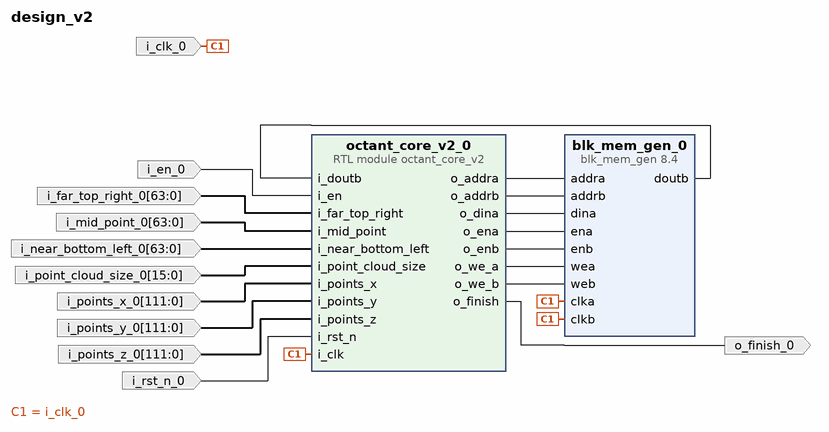
[diagram p0: block diagram of the top level]
# Vivado block design design_v2, xczu7ev-ffvc1156-2-e, Vivado 2021.2
create_bd_design design_v2

create_bd_port -dir I i_en_0
create_bd_port -dir I -from 15 -to 0 i_point_cloud_size_0
create_bd_port -dir I -type rst i_rst_n_0
create_bd_port -dir I -from 63 -to 0 i_mid_point_0
create_bd_port -dir I -from 63 -to 0 i_near_bottom_left_0
create_bd_port -dir I -from 63 -to 0 i_far_top_right_0
create_bd_port -dir I -type clk i_clk_0
create_bd_port -dir O o_finish_0
create_bd_port -dir I -from 111 -to 0 i_points_y_0
create_bd_port -dir I -from 111 -to 0 i_points_x_0
create_bd_port -dir I -from 111 -to 0 i_points_z_0

create_bd_cell -type ip -vlnv xilinx.com:ip:blk_mem_gen:8.4 blk_mem_gen_0
set_property -dict [list \
  CONFIG.Assume_Synchronous_Clk true \
  CONFIG.Enable_32bit_Address false \
  CONFIG.Enable_B Use_ENB_Pin \
  CONFIG.Fill_Remaining_Memory_Locations true \
  CONFIG.Memory_Type True_Dual_Port_RAM \
  CONFIG.Operating_Mode_A NO_CHANGE \
  CONFIG.Operating_Mode_B READ_FIRST \
  CONFIG.PRIM_type_to_Implement BRAM \
  CONFIG.Port_B_Clock 100 \
  CONFIG.Port_B_Enable_Rate 100 \
  CONFIG.Port_B_Write_Rate 50 \
  CONFIG.Read_Width_A 152 \
  CONFIG.Read_Width_B 152 \
  CONFIG.Register_PortA_Output_of_Memory_Primitives false \
  CONFIG.Register_PortB_Output_of_Memory_Primitives false \
  CONFIG.Remaining_Memory_Locations 0 \
  CONFIG.Use_Byte_Write_Enable false \
  CONFIG.Use_RSTA_Pin false \
  CONFIG.Write_Depth_A 16 \
  CONFIG.Write_Width_A 152 \
  CONFIG.Write_Width_B 152 \
  CONFIG.use_bram_block Stand_Alone \
] [get_bd_cells blk_mem_gen_0]
create_bd_cell -type module -reference octant_core_v2 octant_core_v2_0

# ---- connections ----

connect_bd_net [get_bd_pins blk_mem_gen_0/doutb] [get_bd_pins octant_core_v2_0/i_doutb]
connect_bd_net -net i_clk_0_1 [get_bd_ports i_clk_0] \
  [get_bd_pins blk_mem_gen_0/clkb] [get_bd_pins blk_mem_gen_0/clka] [get_bd_pins octant_core_v2_0/i_clk]
connect_bd_net -net i_en_0_1 [get_bd_ports i_en_0] [get_bd_pins octant_core_v2_0/i_en]
connect_bd_net -net i_far_top_right_0_1 [get_bd_ports i_far_top_right_0] [get_bd_pins octant_core_v2_0/i_far_top_right]
connect_bd_net -net i_mid_point_0_1 [get_bd_ports i_mid_point_0] [get_bd_pins octant_core_v2_0/i_mid_point]
connect_bd_net -net i_near_bottom_left_0_1 [get_bd_ports i_near_bottom_left_0] [get_bd_pins octant_core_v2_0/i_near_bottom_left]
connect_bd_net -net i_point_cloud_size_0_1 [get_bd_ports i_point_cloud_size_0] [get_bd_pins octant_core_v2_0/i_point_cloud_size]
connect_bd_net -net i_points_x_0_1 [get_bd_ports i_points_x_0] [get_bd_pins octant_core_v2_0/i_points_x]
connect_bd_net -net i_points_y_0_1 [get_bd_ports i_points_y_0] [get_bd_pins octant_core_v2_0/i_points_y]
connect_bd_net -net i_points_z_0_1 [get_bd_ports i_points_z_0] [get_bd_pins octant_core_v2_0/i_points_z]
connect_bd_net -net i_rst_n_0_1 [get_bd_ports i_rst_n_0] [get_bd_pins octant_core_v2_0/i_rst_n]
connect_bd_net [get_bd_pins octant_core_v2_0/o_addra] [get_bd_pins blk_mem_gen_0/addra]
connect_bd_net [get_bd_pins octant_core_v2_0/o_addrb] [get_bd_pins blk_mem_gen_0/addrb]
connect_bd_net [get_bd_pins octant_core_v2_0/o_dina] [get_bd_pins blk_mem_gen_0/dina]
connect_bd_net [get_bd_pins octant_core_v2_0/o_ena] [get_bd_pins blk_mem_gen_0/ena]
connect_bd_net [get_bd_pins octant_core_v2_0/o_enb] [get_bd_pins blk_mem_gen_0/enb]
connect_bd_net [get_bd_pins octant_core_v2_0/o_finish] [get_bd_ports o_finish_0]
connect_bd_net [get_bd_pins octant_core_v2_0/o_we_a] [get_bd_pins blk_mem_gen_0/wea]
connect_bd_net [get_bd_pins octant_core_v2_0/o_we_b] [get_bd_pins blk_mem_gen_0/web]

validate_bd_design
save_bd_design
